# Altium schematic sheet 03_Power.SchDoc
size A4; SheetNumber: 3; SheetTotal: 7
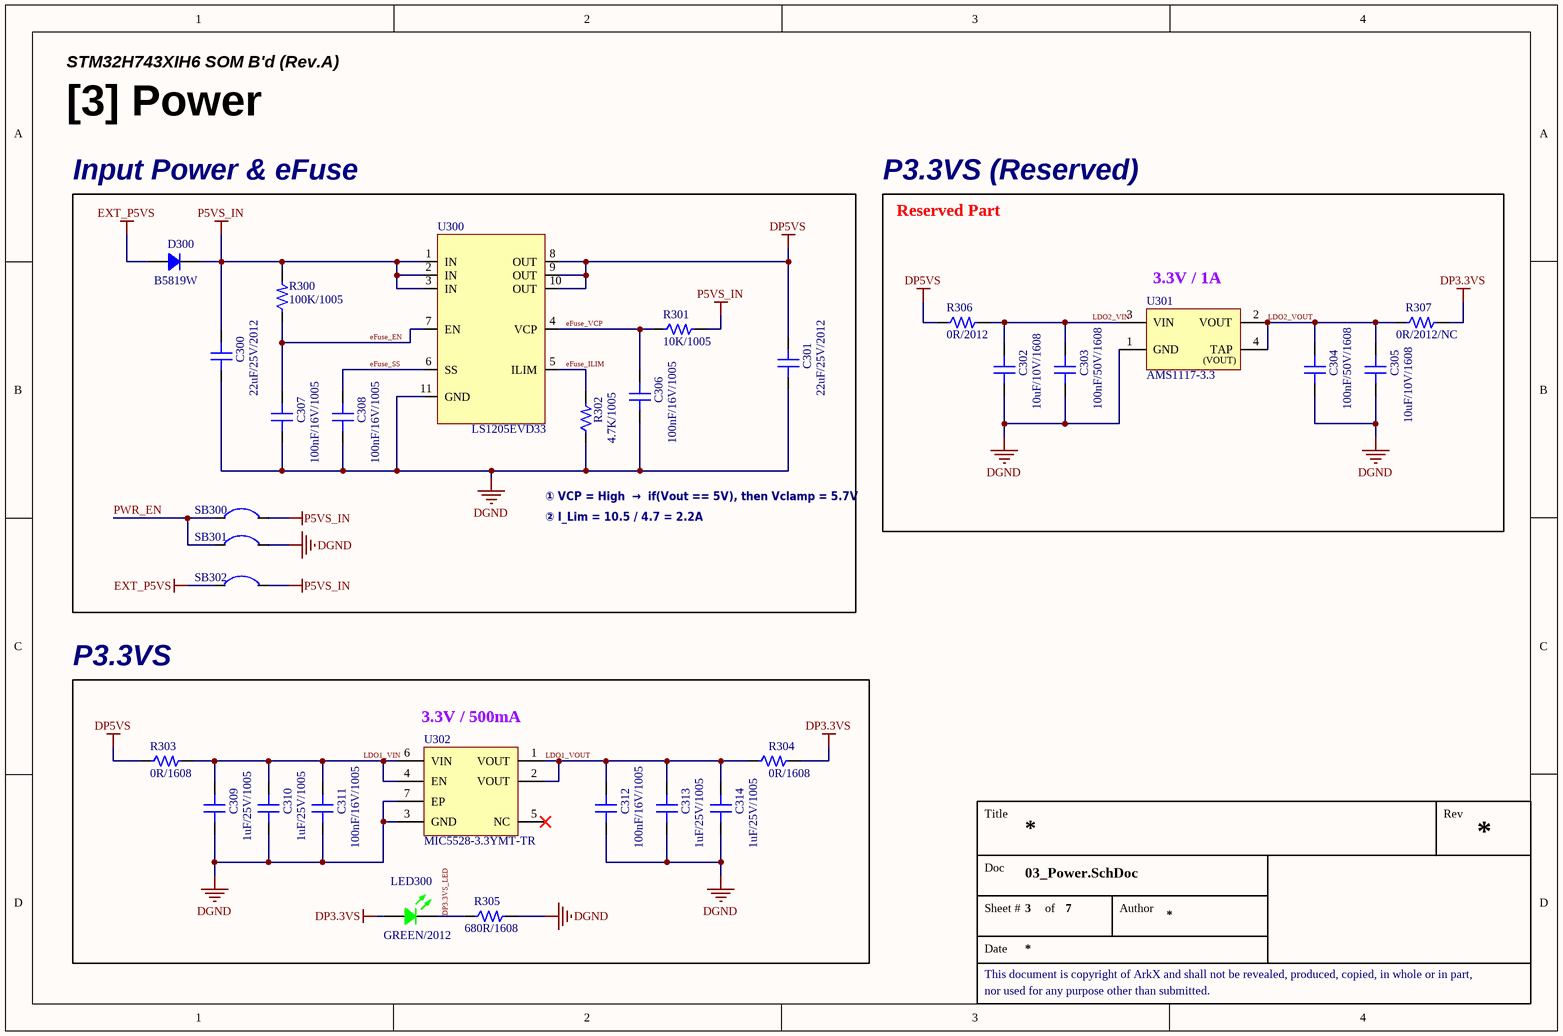
[diagram p0: 03_Power.SchDoc]

## Parts
C300  22uF/25V/2012  [CAP 2012 (0805_INCH)]
C301  22uF/25V/2012  [CAP 2012 (0805_INCH)]
C302  10uF/10V/1608  [CAP 1608 (0603_INCH)]
C303  100nF/50V/1608  [CAP 1608 (0603_INCH)]
C304  100nF/50V/1608  [CAP 1608 (0603_INCH)]
C305  10uF/10V/1608  [CAP 1608 (0603_INCH)]
C306  100nF/16V/1005  [CAP 1005 (0402_INCH)]
C307  100nF/16V/1005  [CAP 1005 (0402_INCH)]
C308  100nF/16V/1005  [CAP 1005 (0402_INCH)]
C309  1uF/25V/1005  [CAP 1005 (0402_INCH)]
C310  1uF/25V/1005  [CAP 1005 (0402_INCH)]
C311  100nF/16V/1005  [CAP 1005 (0402_INCH)]
C312  100nF/16V/1005  [CAP 1005 (0402_INCH)]
C313  1uF/25V/1005  [CAP 1005 (0402_INCH)]
C314  1uF/25V/1005  [CAP 1005 (0402_INCH)]
D300  B5819W  [DIO_SOD-123]
LED300  GREEN/2012  [LED MHT170RGBCT (GREEN)]
R300  100K/1005  [RES 1005 (0402_inch)]
R301  10K/1005  [RES 1005 (0402_inch)]
R302  4.7K/1005  [RES 1005 (0402_inch)]
R303  0R/1608  [RES 1608 (0603_inch)]
R304  0R/1608  [RES 1608 (0603_inch)]
R305  680R/1608  [RES 1608 (0603_inch)]
R306  0R/2012  [RES 2012 (0805_inch)]
R307  0R/2012/NC  [RES 2012 (0805_INCH)/NC]
SB300  SB  [SB (Solder-Bridge)]  (value not drawn)
SB301  SB  [SB (Solder-Bridge)]  (value not drawn)
SB302  SB  [SB (Solder-Bridge)]  (value not drawn)
U300  LS1205EVD33  [IC_DFN_3x3_10L]
U301  AMS1117-3.3  [SOT 223-3 (DIODES INCORPORATED)]
U302  MIC5528-3.3YMT-TR  [IC_TDFN-6]

## Blocks framed on the sheet
Input Power & eFuse: C300 C301 C306-C308 D300 R300-R302 SB300-SB302 U300
P3.3VS (Reserved): C302-C305 R306 R307 U301
P3.3VS: C309-C314 LED300 R303-R305 U302

## Nets
DGND: C300.1 C301.1 C302.1 C303.1 C304.1 C305.1 C306.1 C307.1 C308.1 C309.1 C310.1 C311.1 C312.1 C313.1 C314.1 R302.1 R305.2 SB301.2 U300.11(GND) U301.1(GND) U302.3(GND) U302.7(EP)
DP3.3VS: LED300.4(Common_Anode) R304.2 R307.2
DP5VS: C301.2 R303.1 R306.1 U300.8(OUT) U300.9(OUT) U300.10(OUT)
EXT_P5VS: D300.1 SB302.1
P5VS_IN: C300.2 D300.2 R300.2 R301.2 SB300.2 SB302.2 U300.1(IN) U300.2(IN) U300.3(IN)
DP3.3VS_LED: LED300.2(GREEN) R305.1
eFuse_EN: C307.2 R300.1 U300.7(EN)
eFuse_ILIM: R302.2 U300.5(ILIM)
eFuse_SS: C308.2 U300.6(SS)
eFuse_VCP: C306.2 R301.1 U300.4(VCP)
LDO1_VIN: C309.2 C310.2 C311.2 R303.2 U302.4(EN) U302.6(VIN)
LDO1_VOUT: C312.2 C313.2 C314.2 R304.1 U302.1(VOUT) U302.2(VOUT)
LDO2_VIN: C302.2 C303.2 R306.2 U301.3(VIN)
LDO2_VOUT: C304.2 C305.2 R307.1 U301.2(VOUT) U301.4(TAP)
PWR_EN: SB300.1 SB301.1

Not connected (* = marked no-connect by the designer): U302 5(NC)*

## Notes on the sheet
- STM32H743XIH6 SOM B'd (Rev.A)
- [3] Power
- Reserved Part
- (near U301) 3.3V / 1A
- ① VCP = High  →  if(Vout == 5V), then Vclamp = 5.7V
- ② I_Lim = 10.5 / 4.7 = 2.2A
- (near U302) 3.3V / 500mA
- Title
- Rev
- Doc
- Sheet #
- of
- Author
- This document is copyright of ArkX and shall not be revealed, produced, copied, in whole or in part,
- Date
- nor used for any purpose other than submitted.
- (in symbol IC_REG_AMS1117-3.3) (VOUT)

## Library data of the parts
C300 C301 = CAP_22uF/25V/2012: Ceramic CAP_22uF/25V/2012; LCSC Part #: C45783; JLCPCB Part Type: Basic Part
C302 C305 = CAP_10uF/10V/1608: Ceramic CAP_10uF/10V/1608; LCSC Part #: C19702; JLCPCB Part Type: Basic Part
C303 C304 = CAP_100nF/50V/1608: Ceramic CAP_100nF/50V/1608; LCSC Part #: C14663; JLCPCB Part Type: Basic Part
C306-C308 C311 C312 = CAP_100nF/16V/1005: Ceramic CAP_100nF/16V/1005; LCSC Part #: C1525; JLCPCB Part Type: Basic Part
C309 C310 C313 C314 = CAP_1uF/25V/1005: Ceramic CAP_1uF/25V/1005; LCSC Part #: C52923; JLCPCB Part Type: Basic Part
D300 = DIO_B5819W: 40V 600mV@1A 1A SOD-123  Schottky Barrier Diodes (SBD) ROHS; LCSC Part #: C8598; JLCPCB Part Type: Basic Part
LED300 = LED_MHT170RGBCT(GREEN): Colorless transparence -30℃~+85℃ Positive post Common anode RGB 120° 0805  Light Emitting Diodes (LED) ROHS; LCSC Part #: C2962094; JLCPCB Part Type: Extended Part
R300 = RES_100K/1005/62.5mW: Value: 100K; Power Rating: 62.5mW; Precision: 1%; Size: 1005; LCSC Part #: C25741; JLCPCB Part Type: Basic Part
R301 = RES_10K/1005/62.5mW: Value: 10K; Power Rating: 62.5mW; Precision: 1%; Size: 1005; LCSC Part #: C25744; JLCPCB Part Type: Basic Part
R302 = RES_4.7K/1005/62.5mW: Value: 4.7K; Power Rating: 62.5mW; Precision: 1%; Size: 1005; LCSC Part #: C25900; JLCPCB Part Type: Basic Part
R303 R304 = RES_0R/1608/0.1W: Value: 0R; Power Rating: 0.1W; Precision: 1%; Size: 1608; LCSC Part #: C21189; JLCPCB Part Type: Basic Part
R305 = RES_680R/1608/0.1W: Value: 680R; Power Rating: 0.1W; Precision: 1%; Size: 1608; LCSC Part #: C23228; JLCPCB Part Type: Basic Part
R306 = RES_0R/2012/0.125W: Value: 0R; Power Rating: 0.125W; Precision: 1%; Size: 2012; LCSC Part #: C17477; JLCPCB Part Type: Basic Part
R307 = RES_NC_0R/2012/0.125W: 0R/2012/0.125W/NC; Value: 0R; Power Rating: 0.1W; Precision: 1%; Size: 1608
SB300-SB302 = SB_Solder-Bridge
U300 = IC_eFUSE_LS1205EVD33: 18V, 5A eFuse with Programmable Current Limit and Output Voltage Clamp, 10-DFN (3x3)
U301 = IC_REG_AMS1117-3.3: 72dB@(120Hz) 1A 1.3V@(800mA) Fixed 3.3V~3.3V Positive 1 SOT-223  Linear Voltage Regulators (LDO) ROHS; LCSC Part #: C6186; JLCPCB Part Type: Basic Part
U302 = IC_REG_MIC5528-3.3YMT-TR: Linear Voltage Regulator IC Positive Fixed 1 Output 500mA 6-TDFN (1.2x1.2); LCSC Part #: C622490; JLCPCB Part Type: Extended Part